# EAGLE schematic blimpy-1.0-A (EAGLE 9.5.0)
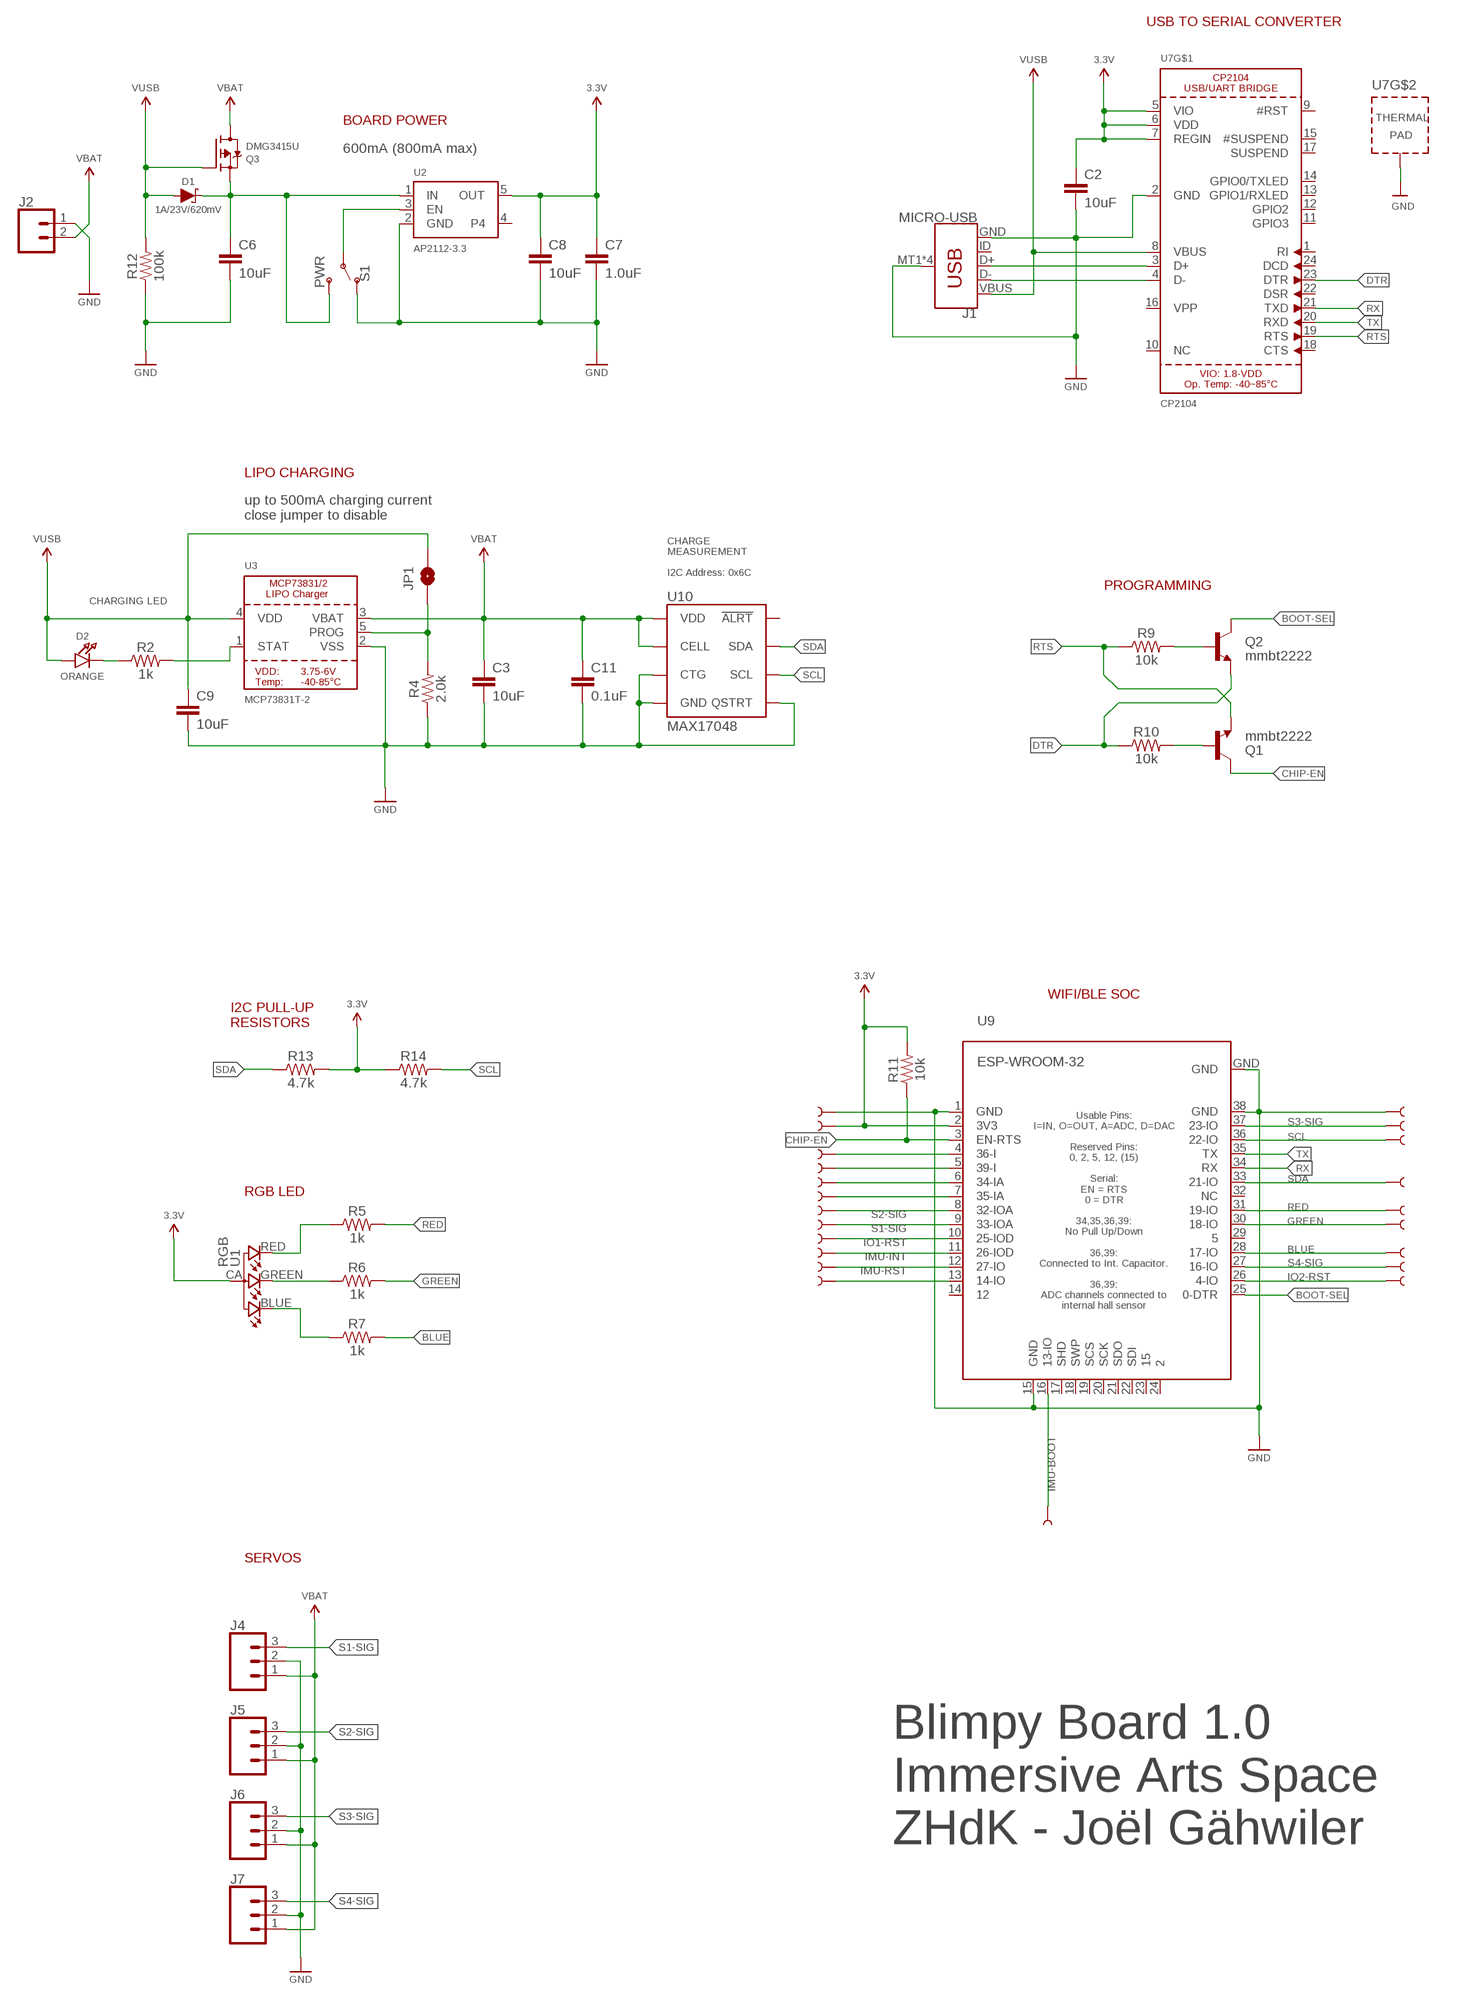
[diagram p0: schematic, sheet 1, part 1 of 2]
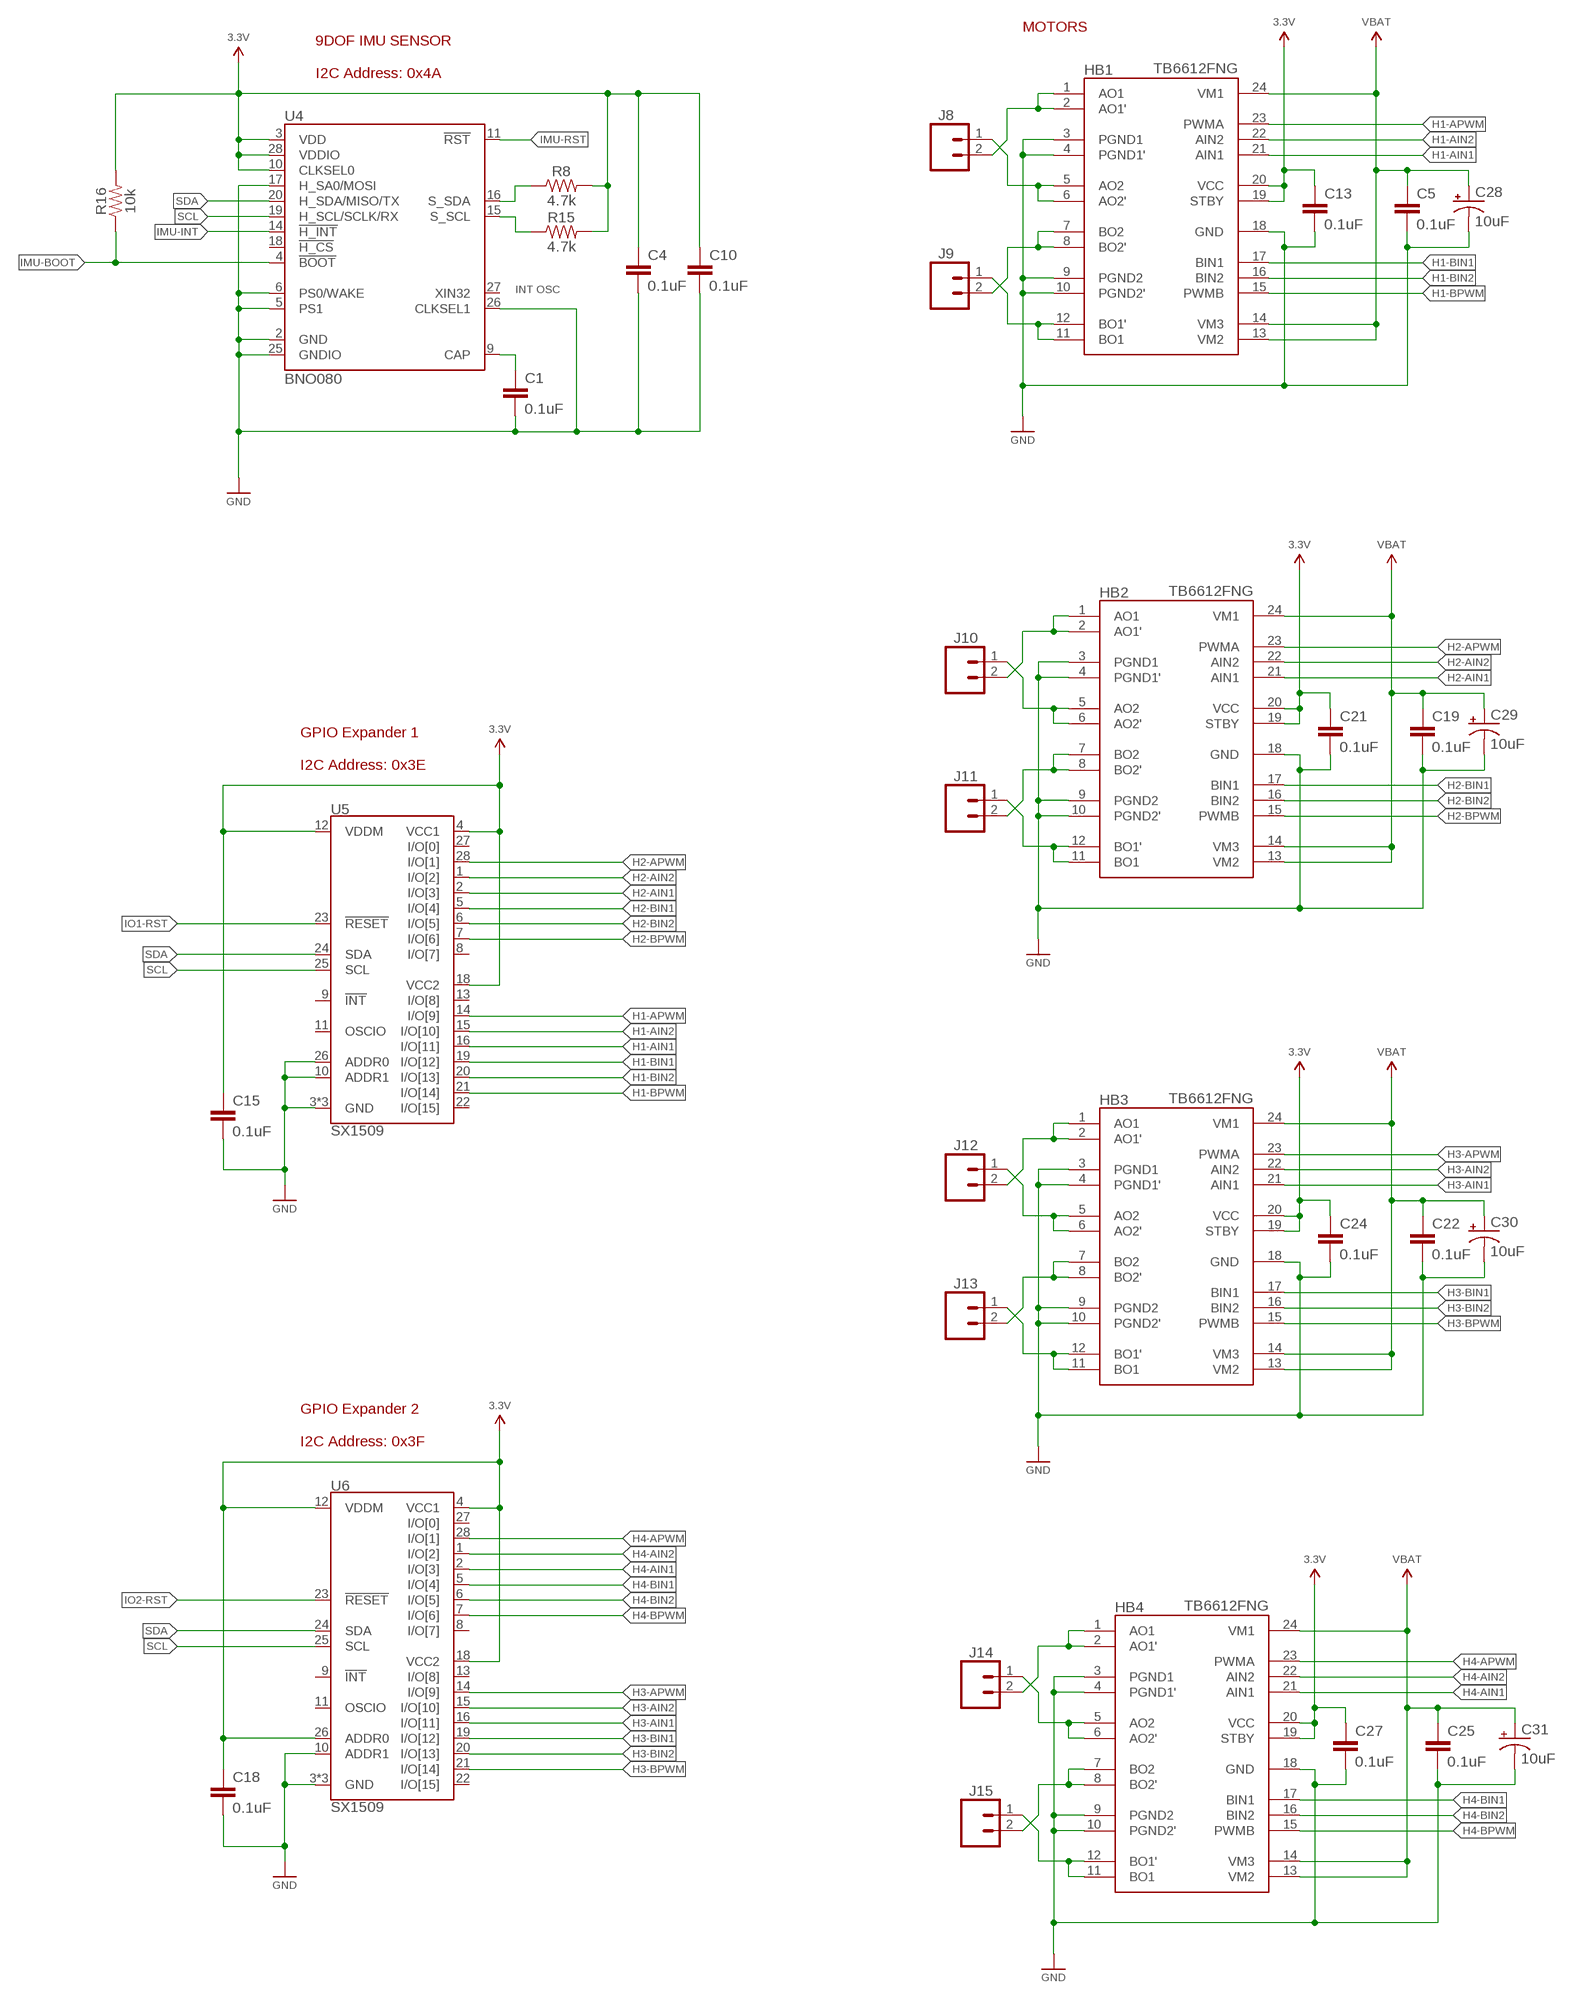
[diagram p1: schematic, sheet 1, part 2 of 2]

## Parts
C1  0.1uF  0.1UF-0603-25V-5%  [0603]
C2  10uF  10UF-0603-6.3V-20%  [0603]
C3  10uF  10UF-0603-6.3V-20%  [0603]
C4  0.1uF  0.1UF-0603-25V-5%  [0603]
C5  0.1uF  0.1UF-0603-25V-5%  [0603]
C6  10uF  10UF-0603-6.3V-20%  [0603]
C7  1.0uF  1.0UF-0603-16V-10%  [0603]
C8  10uF  10UF-0603-6.3V-20%  [0603]
C9  10uF  10UF-0603-6.3V-20%  [0603]
C10  0.1uF  0.1UF-0603-25V-5%  [0603]
C11  0.1uF  0.1UF-0603-25V-5%  [0603]
C13  0.1uF  0.1UF-0603-25V-5%  [0603]
C15  0.1uF  0.1UF-0603-25V-5%  [0603]
C18  0.1uF  0.1UF-0603-25V-5%  [0603]
C19  0.1uF  0.1UF-0603-25V-5%  [0603]
C21  0.1uF  0.1UF-0603-25V-5%  [0603]
C22  0.1uF  0.1UF-0603-25V-5%  [0603]
C24  0.1uF  0.1UF-0603-25V-5%  [0603]
C25  0.1uF  0.1UF-0603-25V-5%  [0603]
C27  0.1uF  0.1UF-0603-25V-5%  [0603]
C28  10uF  10UF-POLAR-EIA3216-16V-10%(TANT)  [EIA3216]
C29  10uF  10UF-POLAR-EIA3216-16V-10%(TANT)  [EIA3216]
C30  10uF  10UF-POLAR-EIA3216-16V-10%(TANT)  [EIA3216]
C31  10uF  10UF-POLAR-EIA3216-16V-10%(TANT)  [EIA3216]
D1  1A/23V/620mV  DIODE-SCHOTTKY-BAT20J  [SOD-323]
D2  ORANGE  LED0805_NOOUTLINE  [CHIPLED_0805_NOOUTLINE]
HB1  TB6612FNG  [SSOP24]
HB2  TB6612FNG  [SSOP24]
HB3  TB6612FNG  [SSOP24]
HB4  TB6612FNG  [SSOP24]
J1  MICRO-USB  USB_MICRO-B_SMT  [USB-MICROB]
J2  CONN_02-JST-2MM-SMT  [JST-2-SMD]
J4  3-PIN SMD  CONN_03JST-SMD  [JST-3-SMD]
J5  3-PIN SMD  CONN_03JST-SMD  [JST-3-SMD]
J6  3-PIN SMD  CONN_03JST-SMD  [JST-3-SMD]
J7  3-PIN SMD  CONN_03JST-SMD  [JST-3-SMD]
J8  CONN_02-JST-2MM-SMT  [JST-2-SMD]
J9  CONN_02-JST-2MM-SMT  [JST-2-SMD]
J10  CONN_02-JST-2MM-SMT  [JST-2-SMD]
J11  CONN_02-JST-2MM-SMT  [JST-2-SMD]
J12  CONN_02-JST-2MM-SMT  [JST-2-SMD]
J13  CONN_02-JST-2MM-SMT  [JST-2-SMD]
J14  CONN_02-JST-2MM-SMT  [JST-2-SMD]
J15  CONN_02-JST-2MM-SMT  [JST-2-SMD]
JP1  JUMPER-SMT_2_NO_SILK  [SMT-JUMPER_2_NO_SILK]
Q1  mmbt2222  TRANSISTOR_NPNSOT23-3  [SOT23-3]
Q2  mmbt2222  TRANSISTOR_NPNSOT23-3  [SOT23-3]
Q3  DMG3415U  MOSFET-P  [SOT23-R]
R2  1k  1KOHM-0603-1/10W-1%  [0603]
R4  2.0k  2.0KOHM-0603-1/10W-5%  [0603]
R5  1k  1KOHM-0603-1/10W-1%  [0603]
R6  1k  1KOHM-0603-1/10W-1%  [0603]
R7  1k  1KOHM-0603-1/10W-1%  [0603]
R8  4.7k  4.7KOHM-0603-1/10W-1%  [0603]
R9  10k  10KOHM-0603-1/10W-1%  [0603]
R10  10k  10KOHM-0603-1/10W-1%  [0603]
R11  10k  10KOHM-0603-1/10W-1%  [0603]
R12  100k  100KOHM-0603-1/10W-1%  [0603]
R13  4.7k  4.7KOHM-0603-1/10W-1%  [0603]
R14  4.7k  4.7KOHM-0603-1/10W-1%  [0603]
R15  4.7k  4.7KOHM-0603-1/10W-1%  [0603]
R16  10k  10KOHM-0603-1/10W-1%  [0603]
S1  PWR  SWITCH-SPDT-SMD-RIGHT-ANGLE  [SWITCH_SPST_SMD_A]
TP1  TEST-POINT3  [PAD.03X.03]
TP2  TEST-POINT3  [PAD.03X.03]
TP3  TEST-POINT3  [PAD.03X.03]
TP4  TEST-POINT3  [PAD.03X.03]
TP5  TEST-POINT3  [PAD.03X.03]
TP6  TEST-POINT3  [PAD.03X.03]
TP7  TEST-POINT3  [PAD.03X.03]
TP8  TEST-POINT3  [PAD.03X.03]
TP9  TEST-POINT3  [PAD.03X.03]
TP10  TEST-POINT3  [PAD.03X.03]
TP11  TEST-POINT3  [PAD.03X.03]
TP12  TEST-POINT3  [PAD.03X.03]
TP13  TEST-POINT3  [PAD.03X.03]
TP14  TEST-POINT3  [PAD.03X.03]
TP15  TEST-POINT3  [PAD.03X.03]
TP16  TEST-POINT3  [PAD.03X.03]
TP17  TEST-POINT3  [PAD.03X.03]
TP18  TEST-POINT3  [PAD.03X.03]
TP19  TEST-POINT3  [PAD.03X.03]
TP20  TEST-POINT3  [PAD.03X.03]
TP21  TEST-POINT3  [PAD.03X.03]
TP22  TEST-POINT3  [PAD.03X.03]
U1  RGB  RGB-LED-CLMVB-FKARGB  [PLCC4-2MM-RGB]
U2  AP2112-3.3  VREG_SOT23-5  [SOT23-5]
U3  MCP73831T-2  MCP73831/2  [SOT23-5]
U4  BNO080  [LGA-28]
U5  SX1509  [QFN-28]
U6  SX1509  [QFN-28]
U7  CP2104  [QFN24_4MM_SMSC]
U9  ESP-WROOM-32  [ESP-WROOM-32]
U10  MAX17048  MAX17048DFN8  [DFN-8]

## Nets
3.3V: C2.1 C4.1 C7.1 C8.1 C10.1 C13.1 C15.1 C18.1 C21.1 C24.1 C27.1 HB1.19(STBY) HB1.20(VCC) HB2.19(STBY) HB2.20(VCC) HB3.19(STBY) HB3.20(VCC) HB4.19(STBY) HB4.20(VCC) R8.2 R11.2 R13.2 R14.1 R15.2 R16.2 TP11.P$1 U1.CA U2.5(OUT) U4.3(VDD) U4.10(CLKSEL0) U4.28(VDDIO) U5.4(VCC1) U5.12(VDDM) U5.18(VCC2) U6.4(VCC1) U6.12(VDDM) U6.18(VCC2) U6.26(ADDR0) U7.5(VIO) U7.6(VDD) U7.7(REGIN) U9.2(3V3)
BLUE: R7.2 TP22.P$1 U9.28(17-IO)
BOOT-SEL: Q2.3(C) U9.25(0-DTR)
CHIP-EN: Q1.3(C) R11.1 U9.3(EN-RTS)
DTR: Q2.2(E) R10.1 U7.23(DTR)
GND: C1.2 C2.2 C3.2 C4.2 C5.2 C6.2 C7.2 C8.2 C9.2 C10.2 C11.2 C13.2 C15.2 C18.2 C19.2 C21.2 C22.2 C24.2 C25.2 C27.2 C28.- C29.- C30.- C31.- HB1.3(PGND1) HB1.4(PGND1') HB1.9(PGND2) HB1.10(PGND2') HB1.18(GND) HB2.3(PGND1) HB2.4(PGND1') HB2.9(PGND2) HB2.10(PGND2') HB2.18(GND) HB3.3(PGND1) HB3.4(PGND1') HB3.9(PGND2) HB3.10(PGND2') HB3.18(GND) HB4.3(PGND1) HB4.4(PGND1') HB4.9(PGND2) HB4.10(PGND2') HB4.18(GND) J1.GND J1.MT1(SHIELD) J1.MT2(SHIELD) J1.P$1(SHIELD) J1.P$2(SHIELD) J2.1 J4.2 J5.2 J6.2 J7.2 R4.1 R12.1 S1.1(O) TP12.P$1 TP13.P$1 U2.2(GND) U3.2(VSS) U4.2(GND) U4.5(PS1) U4.6(PS0/WAKE) U4.17(H_SA0/MOSI) U4.25(GNDIO) U4.26(CLKSEL1) U5.3(GND) U5.10(ADDR1) U5.17(GND) U5.26(ADDR0) U5.29(GND) U6.3(GND) U6.10(ADDR1) U6.17(GND) U6.29(GND) U7.2(GND) U7.THERM(TP) U9.1(GND) U9.15(GND) U9.38(GND) U9.GND U10.P$1(CTG) U10.P$4(GND) U10.P$6(QSTRT) U10.P$9(GND)
GREEN: R6.2 TP21.P$1 U9.30(18-IO)
H1-AIN1: HB1.21(AIN1) U5.16(I/O[11])
H1-AIN2: HB1.22(AIN2) U5.15(I/O[10])
H1-APWM: HB1.23(PWMA) U5.14(I/O[9])
H1-BIN1: HB1.17(BIN1) U5.19(I/O[12])
H1-BIN2: HB1.16(BIN2) U5.20(I/O[13])
H1-BPWM: HB1.15(PWMB) U5.21(I/O[14])
H2-AIN1: HB2.21(AIN1) U5.2(I/O[3])
H2-AIN2: HB2.22(AIN2) U5.1(I/O[2])
H2-APWM: HB2.23(PWMA) U5.28(I/O[1])
H2-BIN1: HB2.17(BIN1) U5.5(I/O[4])
H2-BIN2: HB2.16(BIN2) U5.6(I/O[5])
H2-BPWM: HB2.15(PWMB) U5.7(I/O[6])
H3-AIN1: HB3.21(AIN1) U6.16(I/O[11])
H3-AIN2: HB3.22(AIN2) U6.15(I/O[10])
H3-APWM: HB3.23(PWMA) U6.14(I/O[9])
H3-BIN1: HB3.17(BIN1) U6.19(I/O[12])
H3-BIN2: HB3.16(BIN2) U6.20(I/O[13])
H3-BPWM: HB3.15(PWMB) U6.21(I/O[14])
H4-AIN1: HB4.21(AIN1) U6.2(I/O[3])
H4-AIN2: HB4.22(AIN2) U6.1(I/O[2])
H4-APWM: HB4.23(PWMA) U6.28(I/O[1])
H4-BIN1: HB4.17(BIN1) U6.5(I/O[4])
H4-BIN2: HB4.16(BIN2) U6.6(I/O[5])
H4-BPWM: HB4.15(PWMB) U6.7(I/O[6])
HB1-A1: HB1.1(AO1) HB1.2(AO1') J8.2
HB1-A2: HB1.5(AO2) HB1.6(AO2') J8.1
HB1-B1: HB1.11(BO1) HB1.12(BO1') J9.1
HB1-B2: HB1.7(BO2) HB1.8(BO2') J9.2
HB2-A1: HB2.1(AO1) HB2.2(AO1') J10.2
HB2-A2: HB2.5(AO2) HB2.6(AO2') J10.1
HB2-B1: HB2.11(BO1) HB2.12(BO1') J11.1
HB2-B2: HB2.7(BO2) HB2.8(BO2') J11.2
HB3-A1: HB3.1(AO1) HB3.2(AO1') J12.2
HB3-A2: HB3.5(AO2) HB3.6(AO2') J12.1
HB3-B1: HB3.11(BO1) HB3.12(BO1') J13.1
HB3-B2: HB3.7(BO2) HB3.8(BO2') J13.2
HB4-A1: HB4.1(AO1) HB4.2(AO1') J14.2
HB4-A2: HB4.5(AO2) HB4.6(AO2') J14.1
HB4-B1: HB4.11(BO1) HB4.12(BO1') J15.1
HB4-B2: HB4.7(BO2) HB4.8(BO2') J15.2
IMU-BOOT: R16.1 TP17.P$1 U4.4(!BOOT) U9.16(13-IO)
IMU-INT: TP4.P$1 U4.14(!H_INT) U9.11(26-IOD)
IMU-RST: TP5.P$1 U4.11(!RST) U9.12(27-IO)
IO1-RST: TP3.P$1 U5.23(!RESET) U9.10(25-IOD)
IO2-RST: TP16.P$1 U6.23(!RESET) U9.26(4-IO)
N$1: D2.C R2.1
N$2: J1.D+ U7.3(D+)
N$3: R2.2 U3.1(STAT)
N$4: JP1.1 R4.2 U3.5(PROG)
N$6: J1.D- U7.4(D-)
N$7: C6.1 D1.C Q3.2(S) S1.3(S) U2.1(IN)
N$8: S1.2(P) U2.3(EN)
N$9: R5.1 U1.RED
N$10: R7.1 U1.BLUE
N$11: R6.1 U1.GREEN
N$12: Q1.1(B) R10.2
N$13: Q2.1(B) R9.2
N$14: R8.1 U4.16(S_SDA)
N$15: R15.1 U4.15(S_SCL)
N$16: C1.1 U4.9(CAP)
N$18: TP10.P$1 U9.4(36-I)
N$19: TP9.P$1 U9.5(39-I)
N$20: TP8.P$1 U9.6(34-IA)
N$21: TP7.P$1 U9.7(35-IA)
N$22: TP6.P$1 U9.13(14-IO)
RED: R5.2 TP20.P$1 U9.31(19-IO)
RTS: Q1.2(E) R9.1 U7.19(RTS)
RX: U7.21(TXD) U9.34(RX)
S1-SIG: J4.3 TP2.P$1 U9.9(33-IOA)
S2-SIG: J5.3 TP1.P$1 U9.8(32-IOA)
S3-SIG: J6.3 TP14.P$1 U9.37(23-IO)
S4-SIG: J7.3 TP15.P$1 U9.27(16-IO)
SCL: R14.2 TP18.P$1 U4.19(H_SCL/SCLK/RX) U5.25(SCL) U6.25(SCL) U9.36(22-IO) U10.P$7(SCL)
SDA: R13.1 TP19.P$1 U4.20(H_SDA/MISO/TX) U5.24(SDA) U6.24(SDA) U9.33(21-IO) U10.P$8(SDA)
TX: U7.20(RXD) U9.35(TX)
V_BATT: C3.1 C5.1 C11.1 C19.1 C22.1 C25.1 C28.+ C29.+ C30.+ C31.+ HB1.13(VM2) HB1.14(VM3) HB1.24(VM1) HB2.13(VM2) HB2.14(VM3) HB2.24(VM1) HB3.13(VM2) HB3.14(VM3) HB3.24(VM1) HB4.13(VM2) HB4.14(VM3) HB4.24(VM1) J2.2 J4.1 J5.1 J6.1 J7.1 Q3.3(D) U3.3(VBAT) U10.P$2(CELL) U10.P$3(VDD) ; supply symbol labelled VBAT
V_USB: C9.1 D1.A D2.A J1.VBUS JP1.2 Q3.1(G) R12.2 U3.4(VDD) U7.8(VBUS) ; supply symbol labelled VUSB
Unconnected: J1.ID U2.4 U4.18(!H_CS) U4.27(XIN32) U5.8(I/O[7]) U5.9(!INT) U5.11(OSCIO) U5.13(I/O[8]) U5.22(I/O[15]) U5.27(I/O[0]) U6.8(I/O[7]) U6.9(!INT) U6.11(OSCIO) U6.13(I/O[8]) U6.22(I/O[15]) U6.27(I/O[0]) U7.1(RI) U7.9(#RST) U7.10(NC) U7.11(GPIO3) U7.12(GPIO2) U7.13(GPIO1/RXLED) U7.14(GPIO0/TXLED) U7.15(#SUSPEND) U7.16(VPP) U7.17(SUSPEND) U7.18(CTS) U7.22(DSR) U7.24(DCD) U9.14 U9.17(SHD) U9.18(SWP) U9.19(SCS) U9.20(SCK) U9.21(SDO) U9.22(SDI) U9.23 U9.24 U9.29 U9.32(NC) U10.P$5(!ALRT)

## Notes on the sheet
- MOTORS
- USB TO SERIAL CONVERTER
- 9DOF IMU SENSOR
  
  I2C Address: 0x4A
- BOARD POWER
- 600mA (800mA max)
- INT OSC
- LIPO CHARGING
- up to 500mA charging current
  close jumper to disable
- CHARGE
  MEASUREMENT
  
  I2C Address: 0x6C
- PROGRAMMING
- CHARGING LED
- GPIO Expander 1
  
  I2C Address: 0x3E
- WIFI/BLE SOC
- I2C PULL-UP
  RESISTORS
- RGB LED
- GPIO Expander 2
  
  I2C Address: 0x3F
- SERVOS
- Blimpy Board 1.0
  Immersive Arts Space
  ZHdK - Joël Gähwiler

## Library data of the parts
C1 C4 C5 C10 C11 C13 C15 C18 C19 C21 C22 C24 C25 C27 = SparkFun-Capacitors:0.1UF: 0.1µF ceramic capacitors A capacitor is a passive two-terminal electrical component used to store electrical energy temporarily in an electric field.; PROD_ID: CAP-08604
C2 C3 C6 C8 C9 = SparkFun-Capacitors:10UF: 10.0µF ceramic capacitors A capacitor is a passive two-terminal electrical component used to store electrical energy temporarily in an electric field.; PROD_ID: CAP-11015
C7 = SparkFun-Capacitors:1.0UF: 1µF ceramic capacitors A capacitor is a passive two-terminal electrical component used to store electrical energy temporarily in an electric field.; PROD_ID: CAP-00868
C28-C31 = SparkFun-Capacitors:10UF-POLAR: 10.0µF polarized capacitors A capacitor is a passive two-terminal electrical component used to store electrical energy temporarily in an electric field.; PROD_ID: CAP-00811
D1 = SparkFun-DiscreteSemi:DIODE-SCHOTTKY: Schottky diode A Schottky diode is a semiconductor diode which has a low forward voltage drop and a very fast switching action.; PROD_ID: DIO-11623
D2 = microbuilder:LED: LED 0603 - 0603 Surface Mount Package 2mA: Green LED - Low Power (3.9mcd, 2ma, 1.7Vf) - Digikey: 475-2709-2-ND Orange LED - Low Power (9.8mcd, 2ma, 1.8Vf) - Digikey: 475-1194-2-ND Red LED - Low Power (5mcd, 2ma, 1.8Vf) - Digikey: 475-1195-2-ND Yellow LED - Low Power (7mcd, 2ma, 1.8Vf) - Digikey: 475-1196-2-ND 5mA: Blue LED - Low Power (17mcd, 5ma, 2.9Vf) - Digikey: LNJ937W8CRACT-ND 0805 - 0805 Surface Mount Package 2mA: Red LED (8.8mcd, 2mA, 1.8Vf, Clear) - Low Power [Digikey: 475-2510-1-ND] Green LED (5mcd, 2mA, 1.8Vf, Clear) - Low Power [Digikey: 475-2730-1-ND] Yellow LED (11.3mcd, 2mA, 1.8Vf, Clear) - Low Power [Digikey: 475-2555-1-ND] 20mA: Red LED (104mcd, 20mA, Diffused) - LS R976 [Digikey: 475-1278-6-ND] Red LED (12mcd, 20mA, 2.0Vf, Clear) - APT2012EC [Digikey: 754-1128-1-ND] Green LED (15mcd, 20mA, 2.2Vf, Clear) - APT2012GC [Digikey: 754-1131-1-ND] Orange LED (160mcd, 20mA, 2.1Vf, Clear) - APT2012SECK [Digikey: 754-1130-1-ND] 1206 - 1206 Surface Mount Package Green LED (26mcd, 20mA, Diffused) - LG N971 [Digikey: 475-1407-6-ND] Red LED (15mcd, 20mA, Diffused) - LH N974 [Digikey: 475-1416-6-ND] Cree - Cree High-Power Surface Mount LEDs XPEBWT-L1-0000-00D50 - White 111lm 350mA 2.9Vf 6200K 110° XTEAWT-00-0000-00000LEE3 - White 114lm 350mA 2.85Vf 5000K 115° Everlight - Everlight 45-21 Series Surface Mount LEDs 45-21/QK2C-B2832AC2CB2/2T - Warm White 2000mcd 20mA 3.25Vf 3050K 120° 45-21/LK2C-B38452C4CB2/2T - Nuetral White 2000mcd 20mA 3.25Vf 4150K 120° 45-21/LK2C-B50634C6CB2/2T - Cold White 2200mcd 20mA 3.25Vf 5650K 120° PLCC2 Reverse Mount LS T77K-J1L2-1-0-2-R18-Z - Red 11.25mcd 2mA 1.8Vf 630nm 120° LO T77K-L1M2-24-Z - Orange 19.6mcd 2mA 1.8Vf 606nm 120° LY T77K-K2M1-26-Z - Yellow 15.7mcd 2mA 1.8Vf 587nm 120°
HB1-HB4 = adafruit:TB6612FNG: TB6612FNG MOS dual H-bridge motor driver, 1.2A current 3.2A peak 3 or 5v logic and 3-15v motor
J1 = SparkFun-Connectors:USB_MICRO-B: USB Type Micro-B Connector Male/female and PTH/SMT variants SparkFun Products: SparkFun microB USB Breakout <https://www.sparkfun.com/products/12035> SparkFun USB microB Plug Breakout <https://www.sparkfun.com/products/10031> SparkFun ESP8266 Thing <https://www.sparkfun.com/products/13231>; PROD_ID: CONN-09505; SF_ID: PRT-08533
J2 J8-J15 = SparkFun-Connectors:CONN_02: Multi connection point. Often used as Generic Header-pin footprint for 0.1 inch spaced/style header connections On any of the 0.1 inch spaced packages, you can populate with these: Break Away Headers - Straight <https://www.sparkfun.com/products/116> (PRT-00116) Break Away Male Headers - Right Angle <https://www.sparkfun.com/products/553> (PRT-00553) Female Headers <https://www.sparkfun.com/products/115> (PRT-00115) Break Away Headers - Machine Pin <https://www.sparkfun.com/products/117> (PRT-00117) Break Away Female Headers - Swiss Machine Pin <https://www.sparkfun.com/products/743> (PRT-00743) For SCREWTERMINALS and SPRING TERMINALS visit here: Screw Terimnals on SparkFun.com <https://www.sparkfun.com/search/results?term=Screw+Terminals> (5mm/3.5mm/2.54mm spacing) This device is also useful as a general connection point to wire up your design to another part of your project. Our various solder wires solder well into these plated through hole pads. Hook-Up Wire - Assortment (Stranded, 22 AWG) <https://www.sparkfun.com/products/11375> (PRT-11375) Hook-Up Wire - Assortment (Solid Core, 22 AWG) <https://www.sparkfun.com/products/11367> (PRT-11367) View the entire wire category on our website here <https://www.sparkfun.com/categories/141> Special notes: Molex polarized connector foot print use with: PRT-08233 with associated crimp pins and housings. 2.54_SCREWTERM for use with PRT-10571. 3.5mm Screw Terminal footprints for PRT-08084 5mm Screw Terminal footprints for use with PRT-08432; PROD_ID: CONN-11443
J4-J7 = SparkFun-Connectors:CONN_03: Multi connection point. Often used as Generic Header-pin footprint for 0.1 inch spaced/style header connections On any of the 0.1 inch spaced packages, you can populate with these: Break Away Headers - Straight <https://www.sparkfun.com/products/116> (PRT-00116) Break Away Male Headers - Right Angle <https://www.sparkfun.com/products/553> (PRT-00553) Female Headers <https://www.sparkfun.com/products/115> (PRT-00115) Break Away Headers - Machine Pin <https://www.sparkfun.com/products/117> (PRT-00117) Break Away Female Headers - Swiss Machine Pin <https://www.sparkfun.com/products/743> (PRT-00743) Stackable Header - 3 Pin (Female, 0.1") <https://www.sparkfun.com/products/13875> (PRT-13875) For SCREWTERMINALS and SPRING TERMINALS visit here: Screw Terimnals on SparkFun.com <https://www.sparkfun.com/search/results?term=Screw+Terminals> (5mm/3.5mm/2.54mm spacing) This device is also useful as a general connection point to wire up your design to another part of your project. Our various solder wires solder well into these plated through hole pads. Hook-Up Wire - Assortment (Stranded, 22 AWG) <https://www.sparkfun.com/products/11375> (PRT-11375) Hook-Up Wire - Assortment (Solid Core, 22 AWG) <https://www.sparkfun.com/products/11367> (PRT-11367) View the entire wire category on our website here <https://www.sparkfun.com/categories/141> Special notes: Molex polarized connector foot print use with SKU : PRT-08232 with associated crimp pins and housings.; PROD_ID: CONN-12591
JP1 = SparkFun-Jumpers:JUMPER-SMT_2_NO: Normally open jumper This jumper has two pads in close proximity to each other. Apply solder to close the connection. Round pads are easier to solder for beginners, but are a lot larger. SparkFun Product that uses the round pads: SparkFun EL Sequencer <https://www.sparkfun.com/products/12781>
Q1 Q2 = SparkFun:TRANSISTOR_NPN: Transistor NPN BJT configuration in SOT23 package. MMBT2222 is the common NPN we use. Double check BCE configuration again layout.
Q3 = microbuilder:MOSFET-P: P-Channel Mosfet LEGEND VDS: Voltage Drain-Source ID: Drain Current RDS(ON): Drain-Source On-State Resistance VGS(TH): Gate-Source Threshold Voltage CISS: Drain-Source Input Capacitance SOT-23 Name VDS ID RDS(ON) VGS(TH) CISS Order Number IRLML5103 30V 760mA 600 mOhm -- 75pF @ 25V Digikey: IRLML5103PBFCT-ND IRLML6401 12V 4.3A 50 mOhm 950mV @ 250µA 830pF @ 10V Digikey: IRLML6401PBFTR-ND NTR0202PL 20V 400mA 800 mOhm 2.3V @ 250uA 70pF @ 5V Digikey: NTR0202PLT1GOSTR-ND NTR4101PT1G 20V 1.8A 85 mOhm 1.2V @ 250uA 675pF @ 10V Digikey: NTR4101PT1GOSCT-ND DMP2004K 20V 600mA 900 mOhm 1V @ 250uA 175pF @ 16V Digikey: DMP2004KDICT-ND PMV65XP 20V 3.9A 76 mOhm 950mV @ 1mA 725pF @ 20V Digikey: 568-2358-2-ND TO-252 Name VDS ID RDS(ON) VGS(TH) CISS Order Number AOD417 30V 25A 34 mOhm 3V @ 250µA 920pF @ 15V Digikey: 785-1106-2-ND PowerPak Name VDS ID RDS(ON) VGS(TH) CISS Order Number AON7401 30V 12A 14 mOhm 3V @ 250µA 2600pF @ 15V Digikey: 785-1302-1-ND
R2 R5-R7 = SparkFun-Resistors:1KOHM: 1kΩ resistor A resistor is a passive two-terminal electrical component that implements electrical resistance as a circuit element. Resistors act to reduce current flow, and, at the same time, act to lower voltage levels within circuits. - Wikipedia; PROD_ID: RES-07856
R4 = SparkFun-Resistors:2.0KOHM: 2kΩ resistor A resistor is a passive two-terminal electrical component that implements electrical resistance as a circuit element. Resistors act to reduce current flow, and, at the same time, act to lower voltage levels within circuits. - Wikipedia; PROD_ID: RES-08296
R8 R13-R15 = SparkFun-Resistors:4.7KOHM: 4.7kΩ resistor A resistor is a passive two-terminal electrical component that implements electrical resistance as a circuit element. Resistors act to reduce current flow, and, at the same time, act to lower voltage levels within circuits. - Wikipedia; PROD_ID: RES-07857
R9-R11 R16 = SparkFun-Resistors:10KOHM: 10kΩ resistor A resistor is a passive two-terminal electrical component that implements electrical resistance as a circuit element. Resistors act to reduce current flow, and, at the same time, act to lower voltage levels within circuits. - Wikipedia; PROD_ID: RES-00824
R12 = SparkFun-Resistors:100KOHM: 100kΩ resistor A resistor is a passive two-terminal electrical component that implements electrical resistance as a circuit element. Resistors act to reduce current flow, and, at the same time, act to lower voltage levels within circuits. - Wikipedia; PROD_ID: RES-07828
S1 = SparkFun-Switches:SWITCH-SPDT: Single Pole, Double Throw (SPDT) Switch Single-pole, double-throw (SPDT) switch. Variant Overview SMD-AYZ0202 Surface Mount DPDT Switch <https://www.sparkfun.com/products/597> (COM-00597) Used on e.g. LilyPad Arduino USB - ATmega32U4 Board <https://www.sparkfun.com/products/12049> PTH-11.6X4.0MM SPDT Mini Power Switch <https://www.sparkfun.com/products/102> (COM-00102) Used on e.g. SparkFun Simon Says - Through-Hole Soldering Kit <https://www.sparkfun.com/products/10547> (KIT-10547) PTH-11.6X4.0MM-KIT KIT version of SPDT Mini Power Switch - Simplifies soldering by removing tStop of switch pins - only one side can be soldered. PTH-11.6X4.0MM-LOCK LOCK version of SPDT Mini Power Switch - Offset pins hold switch in place for easier soldering. SMD-RIGHT-ANGLE Surface Mount Right Angle Switch <https://www.sparkfun.com/products/10860> (COM-10860) Used on e.g. SparkFun ESP8266 Thing <https://www.sparkfun.com/products/13231>; PROD_ID: SWCH-10651; SF_SKU: COM-10860
TP1-TP22 = SparkFun-Connectors:TEST-POINT: SparkFun Test Points Bare copper test points for troubleshooting or In-Circuit-Testing. These are used by our Production team for verifying production board runs using pogo-pins on test beds. SparkFun Products: SparkFun LSM9DS1 Breakout <https://www.sparkfun.com/products/13284> SparkFun PSOC <https://www.sparkfun.com/products/13714> SparkFun Load Cell Amplifier <https://www.sparkfun.com/products/13879>
U1 = Particle:RGB-LED-CLMVB-FKA: CREE CLMVB-FKA RGB LED 2mm x 2mm
U2 = microbuilder:VREG_SOT23-5: SOT23-5 Fixed Voltage Regulators Part Current Out V Out V In V Dropout θJA (°C/W) TJ (°C) Digikey Part No. ADP121 150mA 3.3V 3.4-5.5V 0.09V @ 150mA -- -- ADP121-AUJZ33R7CT-ND ADP121 150mA 3.0V 3.1-5.5V 0.09V @ 150mA -- -- ADP121-AUJZ30R7CT-ND ADP122 300mA 3.3V 3.4-5.5V 0.085V @ 300mA -- -- ADP122AUJZ-3.3-R7CT-ND ADP1712 300mA 3.3V 3.5-5.5V 0.17V @ 300mA -- -- ADP1712AUJZ-3.3-R7TR-ND AP7311 (Low Cost) 150mA 3.3V 3.5-6V 0.15V @ 150mA -- -- AP7311-33WG-7DICT-ND LD39015M18R 150mA 1.8V 1.9V-5.5V 0.08V @ 100mA -- -- 497-6977-1-ND LP2985A-33DBVR 150mA 3.3V 3.3-16V 0.28V @ 150mA 206 150 296-18479-1-ND MCP1824T-3302E/OT 300mA 3.3V 3.5V-6V 0.2V @ 300mA -- -- MCP1824T-3302E/OTCT-ND MIC5205-2.5YM5 TR 150mA 2.5V 2.7-16V 0.165V @ 150mA -- -- 576-1257-2-ND MIC5205-3.0YM5 TR 150mA 3.0V 3.2V-16V 0.165V @ 150mA -- -- 576-1258-2-ND MIC5205-3.3YM5 TR 150mA 3.3V 3.5V-16V 0.165V @ 150mA -- -- 576-1259-2-ND TPS780330220 150mA 3.3V+2.2V 3.6-5.5V 250mV Max -- -- 296-23332-1-ND TDA3663/N1,135 100mA 3.3V 3.5-45V 0.18V @ 50mA -- -- 568-5343-1-ND Max operating temp can be calculated using θJA, TJ (max junction temperature), and power in watts. Set the "Maximum Ambient Temperature" until it reaches TJ ("Max Junction Temperature"), which is the absolute limit for safe use of the regulator: Heat Sink Temperature Calculator <http://www.daycounter.com/Calculators/Heat-Sink-Temperature-Calculator.phtml> For example, With 12V source into a 3.3V LP2985 and a 30mA load, we are dissipating (12V-3.3V) * 0.03A = 0.261W. With a θJA of 206 °C/W, a TJ of 150°C, and 261mW we can safely use the chip without a heat sink up to 75°C (=147.1°C Junction Temperature).
U3 = microbuilder:MCP73831/2: MCP73831/2 LIPO Charger VDD: 3.75 - 6V Temp -40 - 85°C Programmable Charge Rate: 15-500mA NOTE: STAT is a tri-state logic output on the MCP73831 and an open-drain output on the MCP73832. SOT23-5 with 4.2V output and tri-state logic on STAT = MCP73831T-2ACI/OT
U4 = BNO080:BNO080
U5 U6 = SparkFun-IC-Special-Function:SX1509: Semtech SX1509 The SX1509 is a complete ultra low voltage 1.2V to 3.6V General Purpose parallel Input/Output (GPIO) expanders ideal for low power handheld battery powered equipment. This version comes in a 16-channel configuration and allows easy serial expansion of I/O through a standard 400kHz I2C interface. GPIO devices can provide additional control and monitoring when the microcontroller or chipset has insufficient I/O ports, or in systems where serial communication and control from a remote location is advantageous. Datasheet <http://cdn.sparkfun.com/datasheets/BreakoutBoards/sx1509.pdf> SparkFun Products SparkFun 16 Output I/O Expander Breakout - SX1509 <https://www.sparkfun.com/products/13601> (BOB-13601) SparkFun Line Follower Array <https://www.sparkfun.com/products/13582> (SEN-13582); PROD_ID: IC-11311
U7 = microbuilder:CP2104: CP2104 - USB to UART Bridge VDD Output: 3.45V
U9 = ESP32:ESP-WROOM-32
U10 = SparkFun-IC-Power:MAX17048: Micropower 1-Cell Li+ ModelGauge SparkFun Products Qduino Mini <https://www.sparkfun.com/products/13614> (DEV-13614); PROD_ID: IC-12551